# Altium schematic sheet UU-PCBA-MANT_Top.SchDoc
size A
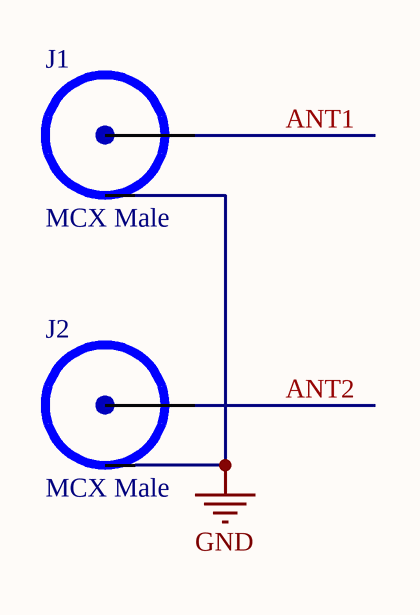
[diagram p0: UU-PCBA-MANT_Top.SchDoc]

## Parts
J1  MCX Male  [RSP-199156-01]
J2  MCX Male  [RSP-199156-01]

## Nets
GND: J1.0(GND) J2.0(GND)
ANT1: J1.1(SIG)
ANT2: J2.1(SIG)

## Library data of the parts
J1 J2 = RSP-199156-01: Samtec MODIFIED 50 OHM MCX JACK PLUG, THROUGH-HOLE